# EAGLE design RC_car (EAGLE 9.6.2)
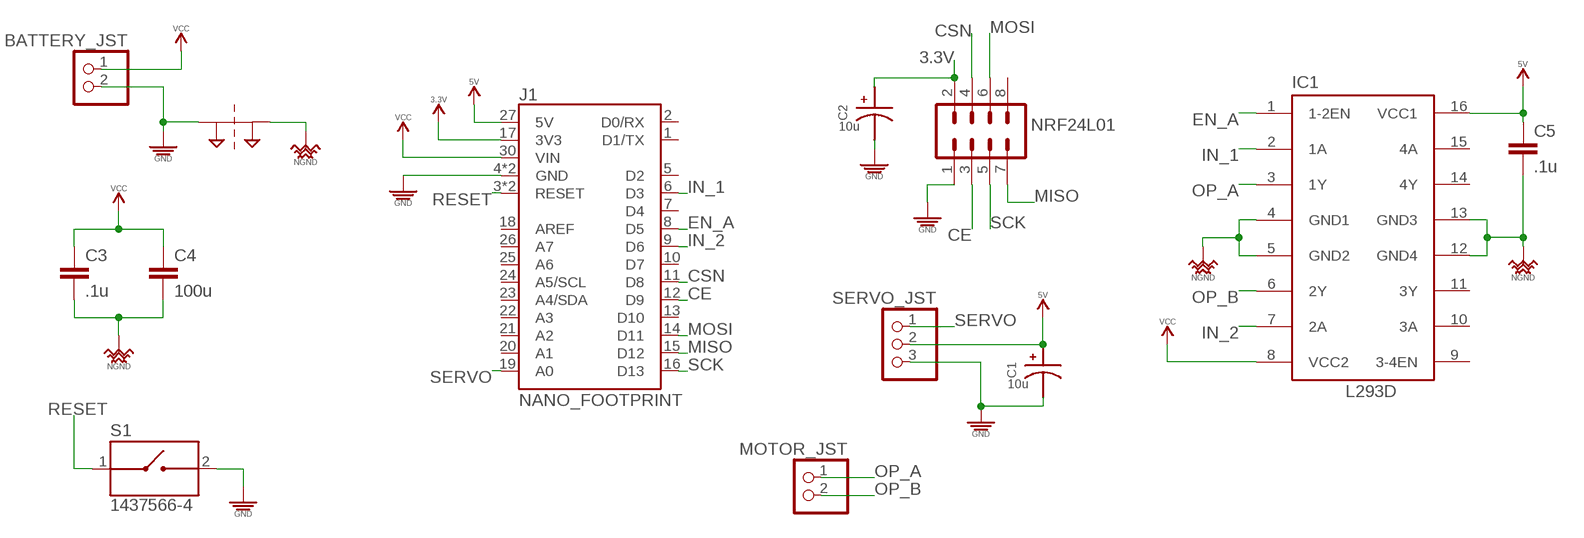
[diagram p0: schematic, sheet 1]

## Parts
BATTERY_JST  PINHD-1X2  [1X02]
C1  10u  UVR1E100MDD  [CAPPRD200W50D550H1250]
C2  10u  UVR1E100MDD  [CAPPRD200W50D550H1250]
C3  .1u  C2,5-3  [C2.5-3]
C4  100u  C2,5-3  [C2.5-3]
C5  .1u  C2,5-3  [C2.5-3]
IC1  L293D  [DIL16]
J1  NANO_FOOTPRINT  [NANO]
MOTOR_JST  PINHD-1X2  [1X02]
NET_BRIDGE1  NET_BRIDGE  [NET_BRIDGE]
NRF24L01  MA04-2  [MA04-2]
S1  1437566-4  [SW_1437566-4]
SERVO_JST  PINHD-1X3  [1X03]

## Nets
3.3V: C2.1 J1.17(3V3) NRF24L01.2
5V: C1.1 C5.1 IC1.16(VCC1) J1.27(5V) SERVO_JST.2
CE: J1.12(D9) NRF24L01.3
CSN: J1.11(D8) NRF24L01.4
EN_A: IC1.1(1-2EN) J1.8(D5)
GND: BATTERY_JST.2 C1.2 C2.2 J1.4(GND) J1.29(GND) NET_BRIDGE1.P$1 NRF24L01.1 S1.2 SERVO_JST.3
IN_1: IC1.2(1A) J1.6(D3)
IN_2: IC1.7(2A) J1.9(D6)
MISO: J1.15(D12) NRF24L01.7
MOSI: J1.14(D11) NRF24L01.6
NGND: C3.2 C4.2 C5.2 IC1.4(GND1) IC1.5(GND2) IC1.12(GND4) IC1.13(GND3) NET_BRIDGE1.P$2
OP_A: IC1.3(1Y) MOTOR_JST.1
OP_B: IC1.6(2Y) MOTOR_JST.2
RESET: J1.3(RESET) J1.28(RESET) S1.1
SCK: J1.16(D13) NRF24L01.5
SERVO: J1.19(A0) SERVO_JST.1
VCC: BATTERY_JST.1 C3.1 C4.1 IC1.8(VCC2) J1.30(VIN)
Unconnected: IC1.9(3-4EN) IC1.10(3A) IC1.11(3Y) IC1.14(4Y) IC1.15(4A) J1.1(D1/TX) J1.2(D0/RX) J1.5(D2) J1.7(D4) J1.10(D7) J1.13(D10) J1.18(AREF) J1.20(A1) J1.21(A2) J1.22(A3) J1.23(A4/SDA) J1.24(A5/SCL) J1.25(A6) J1.26(A7) NRF24L01.8

## Library data of the parts
BATTERY_JST MOTOR_JST = pinhead:PINHD-1X2: PIN HEADER
C1 C2 = UVR1E100MDD:UVR1E100MDD: 0.47µF 100V Aluminum Electrolytic Capacitors Radial, Can 2000 Hrs @ 85°C; DESCRIPTION: 10 µF 25 V Aluminum Electrolytic Capacitors Radial, Can - 2000 Hrs @ 85°C; DIGI-KEY_PART_NUMBER: UVR1E100MDD1TA-ND; MF: Nichicon; MP: UVR1E100MDD; PACKAGE: Radial Nichicon; PURCHASE-URL: https://pricing.snapeda.com/search/part/UVR1E100MDD/?ref=eda
C3-C5 = capacitor-wima:C: CAPACITOR naming: grid - package width
IC1 = st-microelectronics:L293D: PUSH-PULL 4 CHANNEL DRIVER; MPN: L293D; OC_FARNELL: 9589619; OC_NEWARK: 56P8249
J1 = SparkFun-Boards:NANO_FOOTPRINT: Generic Nano Footprint
NET_BRIDGE1 = PiB_power_symbols:NET_BRIDGE
NRF24L01 = con-lstb:MA04-2: PIN HEADER; OC_FARNELL: unknown; OC_NEWARK: unknown
S1 = 1437566-4:1437566-4: SWITCH TACTILE SPST-NO 0.05A 24V; COMMENT: 1437566-4; CONFIGURATION_POLE-THROW: Single Pole - Single Throw; CONTACT_CURRENT_RATING: 50 mA; DESCRIPTION: Tactile Switch SPST-NO Top Actuated Surface Mount; DIGI-KEY_PART_NUMBER: 2266-1437566-4TR-ND; MF: TE Connectivity; MP: 1437566-4; PACKAGE: None
SERVO_JST = pinhead:PINHD-1X3: PIN HEADER

## Board
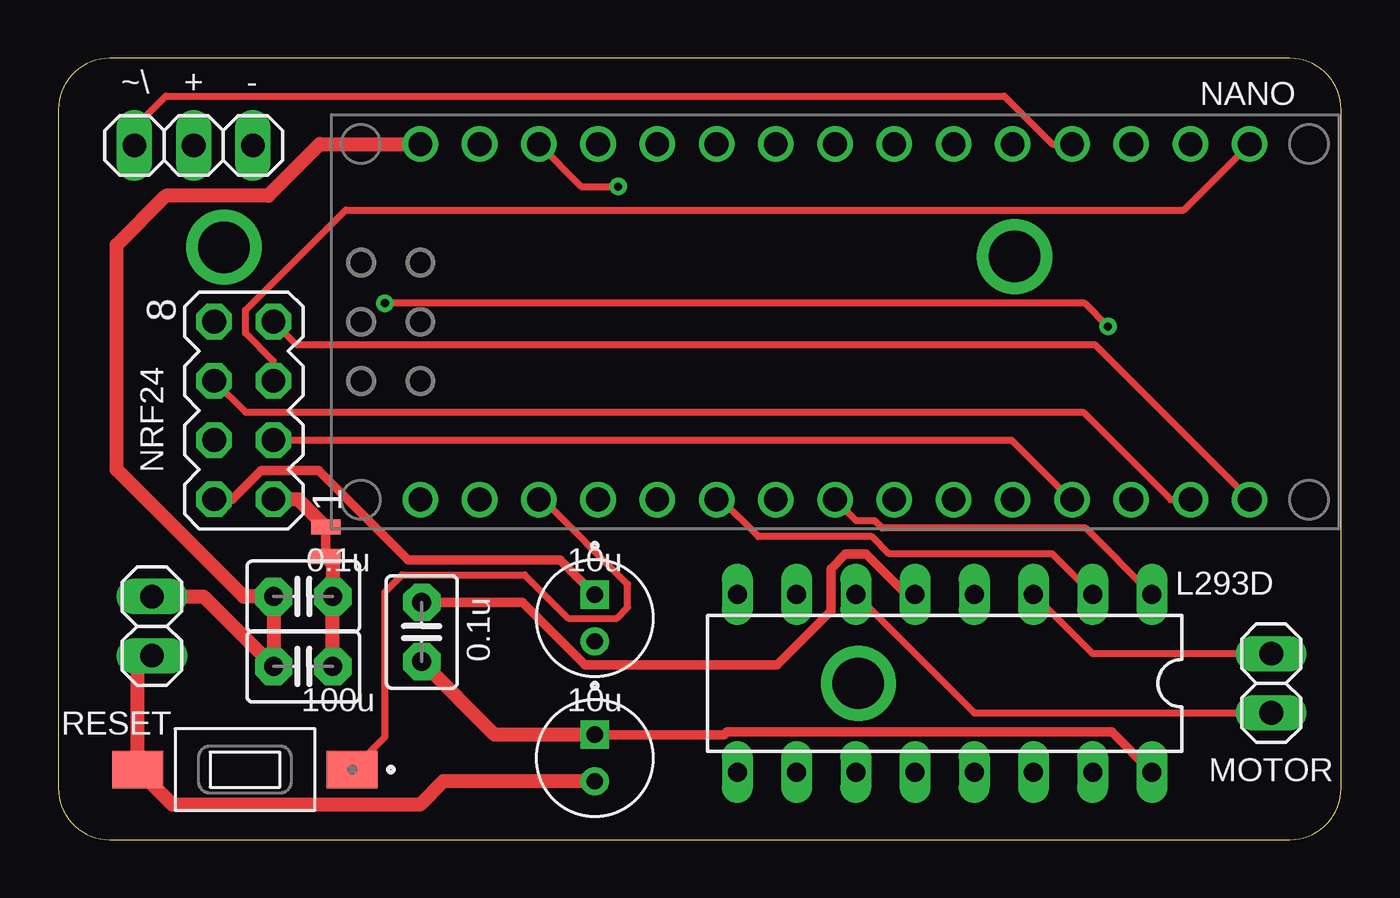
[diagram p1: board, top side]
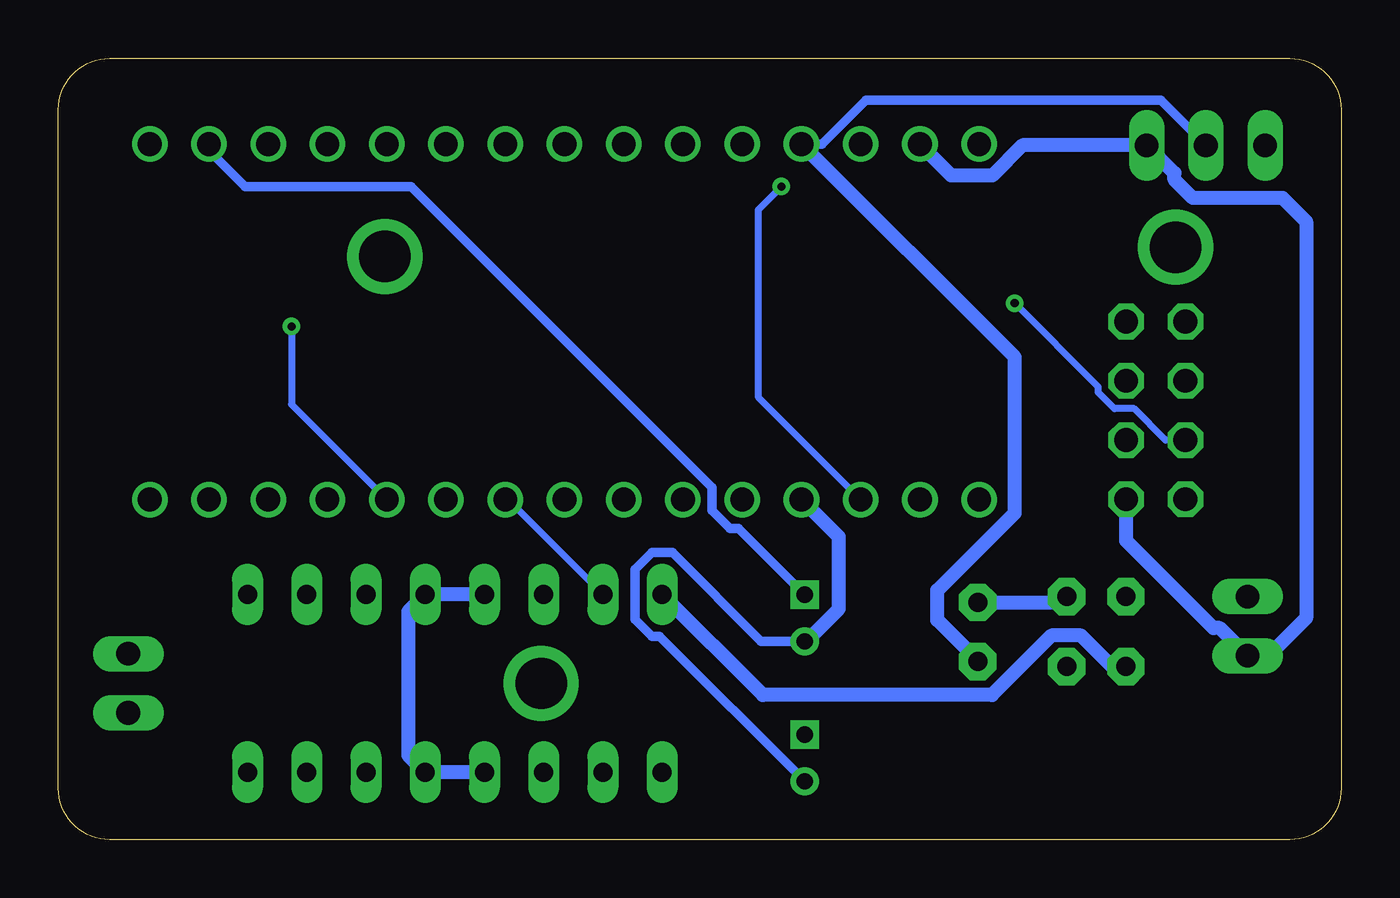
[diagram p2: board, bottom side, seen from below]

Size 55 x 33.5 mm. Coordinates in mm from the lower left corner, seen from the top.
Outline: 55,2.2 55,31.3 arc90 52.8,33.5 2.2,33.5 arc90 0,31.3 0,2.2 arc90 2.2,0 52.8,0 arc90 55,2.2
Copper layers (1*16): Top 0.035mm / dielectric 1.5mm / Bottom 0.035mm
Design rules "PCBway": minimum track width 6mil, minimum drill 0.3mm, track to track 0.205mm, track to pad 0.205mm, pad to pad 0.205mm, via to via 0.205mm, smd to smd 8mil, copper to edge 40mil, drill to drill 8mil, minimum pad ring 10mil, minimum via ring 8mil, stop-mask expansion 4mil, vias tented up to drill 25mil, thermal gap 10mil

### Footprints (pad centres in the part's own frame; a part is rotated, then mirrored left to right if it is on the bottom)
1X02 = drill 1.016 long: 1 -1.27,0; 2 1.27,0
CAPPRD200W50D550H1250 = drill 0.7 square: 1 -1,0 | drill 0.7: 2 1,0
C2.5-3 = drill 0.813 pad 1.6 octagon: 1 -1.27,0; 2 1.27,0
DIL16 = drill 0.813 long: 1 -8.89,-3.81; 2 -6.35,-3.81; 3 -3.81,-3.81; 4 -1.27,-3.81; 5 1.27,-3.81; 6 3.81,-3.81; 7 6.35,-3.81; 8 8.89,-3.81; 9 8.89,3.81; 10 6.35,3.81; 11 3.81,3.81; 12 1.27,3.81; 13 -1.27,3.81; 14 -3.81,3.81; 15 -6.35,3.81; 16 -8.89,3.81
NANO = drill 1.016: 1 -7.62,17.78; 2 -7.62,15.24; 3 -7.62,12.7; 4 -7.62,10.16; 5 -7.62,7.62; 6 -7.62,5.08; 7 -7.62,2.54; 8 -7.62,0; 9 -7.62,-2.54; 10 -7.62,-5.08; 11 -7.62,-7.62; 12 -7.62,-10.16; 13 -7.62,-12.7; 14 -7.62,-15.24; 15 -7.62,-17.78; 16 7.62,-17.78; 17 7.62,-15.24; 18 7.62,-12.7; 19 7.62,-10.16; 20 7.62,-7.62; 21 7.62,-5.08; 22 7.62,-2.54; 23 7.62,0; 24 7.62,2.54; 25 7.62,5.08; 26 7.62,7.62; 27 7.62,10.16; 28 7.62,12.7; 29 7.62,15.24; 30 7.62,17.78
NET_BRIDGE = smd 0.635 x 1.27: P$1 -0.635,0; P$2 0.635,0
MA04-2 = drill 1.016 octagon: 1 -3.81,-1.27; 2 -3.81,1.27; 3 -1.27,-1.27; 4 -1.27,1.27; 5 1.27,-1.27; 6 1.27,1.27; 7 3.81,-1.27; 8 3.81,1.27
SW_1437566-4 = smd 2.18 x 1.6: 1 -4.6,0; 2 4.6,0
1X03 = drill 1.016 long: 1 -2.54,0; 2 0,0; 3 2.54,0

### Placement (x,y rotation side)
BATTERY_JST  4.01,9.15 270 top
C1  23,3.5 270 top
C2  23,9.5 270 top
C3  10.5,7.42 0 top
C4  10.5,10.42 0 top
C5  15.58,8.9 90 top
IC1  38,6.7 180 top
J1  33.3,22.2 90 top
MOTOR_JST  52,6.7 270 top
NET_BRIDGE1  11.47,12.77 270 top
NRF24L01  7.95,18.4 90 top
S1  8,3 180 top
SERVO_JST  5.8,29.77 0 top

### Tracks (layer width: path | path; a pad name or v marks a point on that pad's centre or on a via)
3.3V
  Top 0.406: NRF24L01.2 7.46,14.59 8.7,15.84 11.16,15.84 15,12 21.5,12 C2.1
  Bottom 0.406: C2.1 25.84,13.34 26.2,13.34 26.98,14.12 26.98,15.1 39.88,28 47,28 48.54,29.54 J1.17
5V
  Top 0.406: C1.1 28.55,4.5 28.67,4.62 45.16,4.62 IC1.16
  Top 0.61: C1.1 18.71,4.5 C5.1
  Bottom 0.406: J1.27 22.25,29.82 20.37,31.7 7.73,31.7 SERVO_JST.2
  Bottom 0.61: C5.1 15.58,7.68 17.31,9.41 17.31,10.69 14,14 14,20.68 J1.27
CE
  Top 0.305: NRF24L01.3 40.87,17.13 43.42,14.58 J1.12
CSN  (via drill 0.35)
  Top 0.305: v14,23 44,23 v45,22
  Bottom 0.305: v14,23 10.41,19.41 10.41,19.18 9.71,18.48 8.88,18.48 7.53,17.13 NRF24L01.4 | v45,22 45,18.66 J1.11
EN_A
  Top 0.305: IC1.1 44.05,13.35 35.33,13.35 35.01,13.67 34.21,13.67 J1.8
GND
  Top 0.61: C1.2 16.5,2.5 15.5,1.5 4.9,1.5 S1.2 3.4,7.27 BATTERY_JST.2 | NET_BRIDGE1.P$1 10.29,14.59 NRF24L01.1
  Bottom 0.406: C2.2 24.87,8.5 28.67,12.3 29.55,12.3 30.27,11.58 30.27,9.44 29.55,8.72 29.22,8.72 C1.2
  Bottom 0.61: C2.2 22.93,8.5 21.54,9.89 21.54,12.98 J1.4 | NRF24L01.1 9.22,12.81 5.48,9.07 5.2,9.07 BATTERY_JST.2 3.12,7.88 1.5,9.5 1.5,26.5 2.51,27.51 6.36,27.51 7.15,28.3 7.15,28.58 SERVO_JST.3 13.67,29.77 14.96,28.47 16.71,28.47 J1.29
IN_1
  Top 0.305: IC1.2 42.61,12.25 35.61,12.25 34.88,12.99 30.01,12.99 28.42,14.58 J1.6
IN_2
  Bottom 0.305: IC1.7 35.72,14.58 J1.9
MISO
  Top 0.305: NRF24L01.7 10.22,21.21 44.45,21.21 J1.15
MOSI
  Top 0.305: NRF24L01.6 8.03,18.32 43.94,18.32 47.69,14.58 J1.14
N$1  (via drill 2.2 pad 3)
  other vias: 41,25
N$2  (via drill 2.2 pad 3)
  other vias: 34.3,6.7
N$3  (via drill 2.2 pad 3)
  other vias: 7.1,25.4
NGND
  Top 0.406: C5.2 19.9,10.17 22.58,7.49 23.42,7.49 23.43,7.5 30.81,7.5 33.12,9.81 33.12,11.61 33.75,12.24 34.63,12.24 36.36,10.51 IC1.5
  Top 0.61: C3.2 C4.2 11.77,11.84 NET_BRIDGE1.P$2
  Bottom 0.61: IC1.12 IC1.13 40,3.62 40,9.78 IC1.4 IC1.5 | C5.2 12.02,10.17 C4.2
OP_A
  Top 0.305: MOTOR_JST.1 44.35,7.97 IC1.3
OP_B
  Top 0.305: IC1.6 39.27,5.43 MOTOR_JST.2
RESET  (via drill 0.35)
  Top 0.305: S1.1 14,4.4 14,10.62 14.73,11.35 20,11.35 21.85,9.49 23.95,9.49 24.41,9.95 24.41,10.95 20.77,14.58 J1.3 | J1.28 22.42,28 v24,28
  Bottom 0.305: v24,28 25,27 25,18.98 J1.3
SCK
  Top 0.305: NRF24L01.5 9.22,20.52 8.03,21.72 8.03,22.7 12.32,27 48.26,27 J1.16
SERVO
  Top 0.305: J1.19 42.61,29.82 40.55,31.88 4.61,31.88 3.26,30.53 SERVO_JST.1
VCC
  Top 0.61: BATTERY_JST.1 6.23,10.42 C3.1 C4.1 7.95,10.42 2.5,15.87 2.5,25.5 4.61,27.61 9,27.61 11.21,29.82 J1.30
  Bottom 0.61: C3.1 9.83,7.42 11.16,8.75 12.42,8.75 14.97,6.2 24.8,6.2 IC1.8

### Text on the board
tPlace: ~\ | + | - | NANO | NRF24 | 0.1u | 10u | L293D | 0.1u | 100u | 10u | RESET | MOTOR